# Altium schematic sheet Battery_Source.SchDoc
size A4
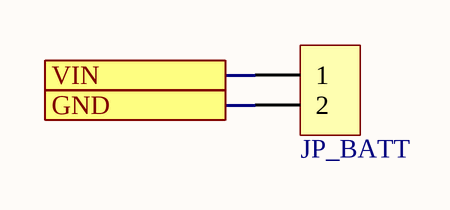
[diagram p0: Battery_Source.SchDoc]

## Parts
JP_BATT  HDR-1X2  [XH2.54-WI-2P]  (value not drawn)

## Ports
GND, VIN

## Nets
GND: JP_BATT.2 ; port GND
VIN: JP_BATT.1 ; port VIN

## Library data of the parts
JP_BATT = Header 2: 2P接插件; 版权归属: 源创客; BOM名称: 2P接插件; 学习资源: www.ooocke.com